# EAGLE design flight_logger_r1 (EAGLE 5.07)
MANUF: diodes:DMP2160UW;; PARTNUM: DMP2160UW

## Sheet 1 of 3
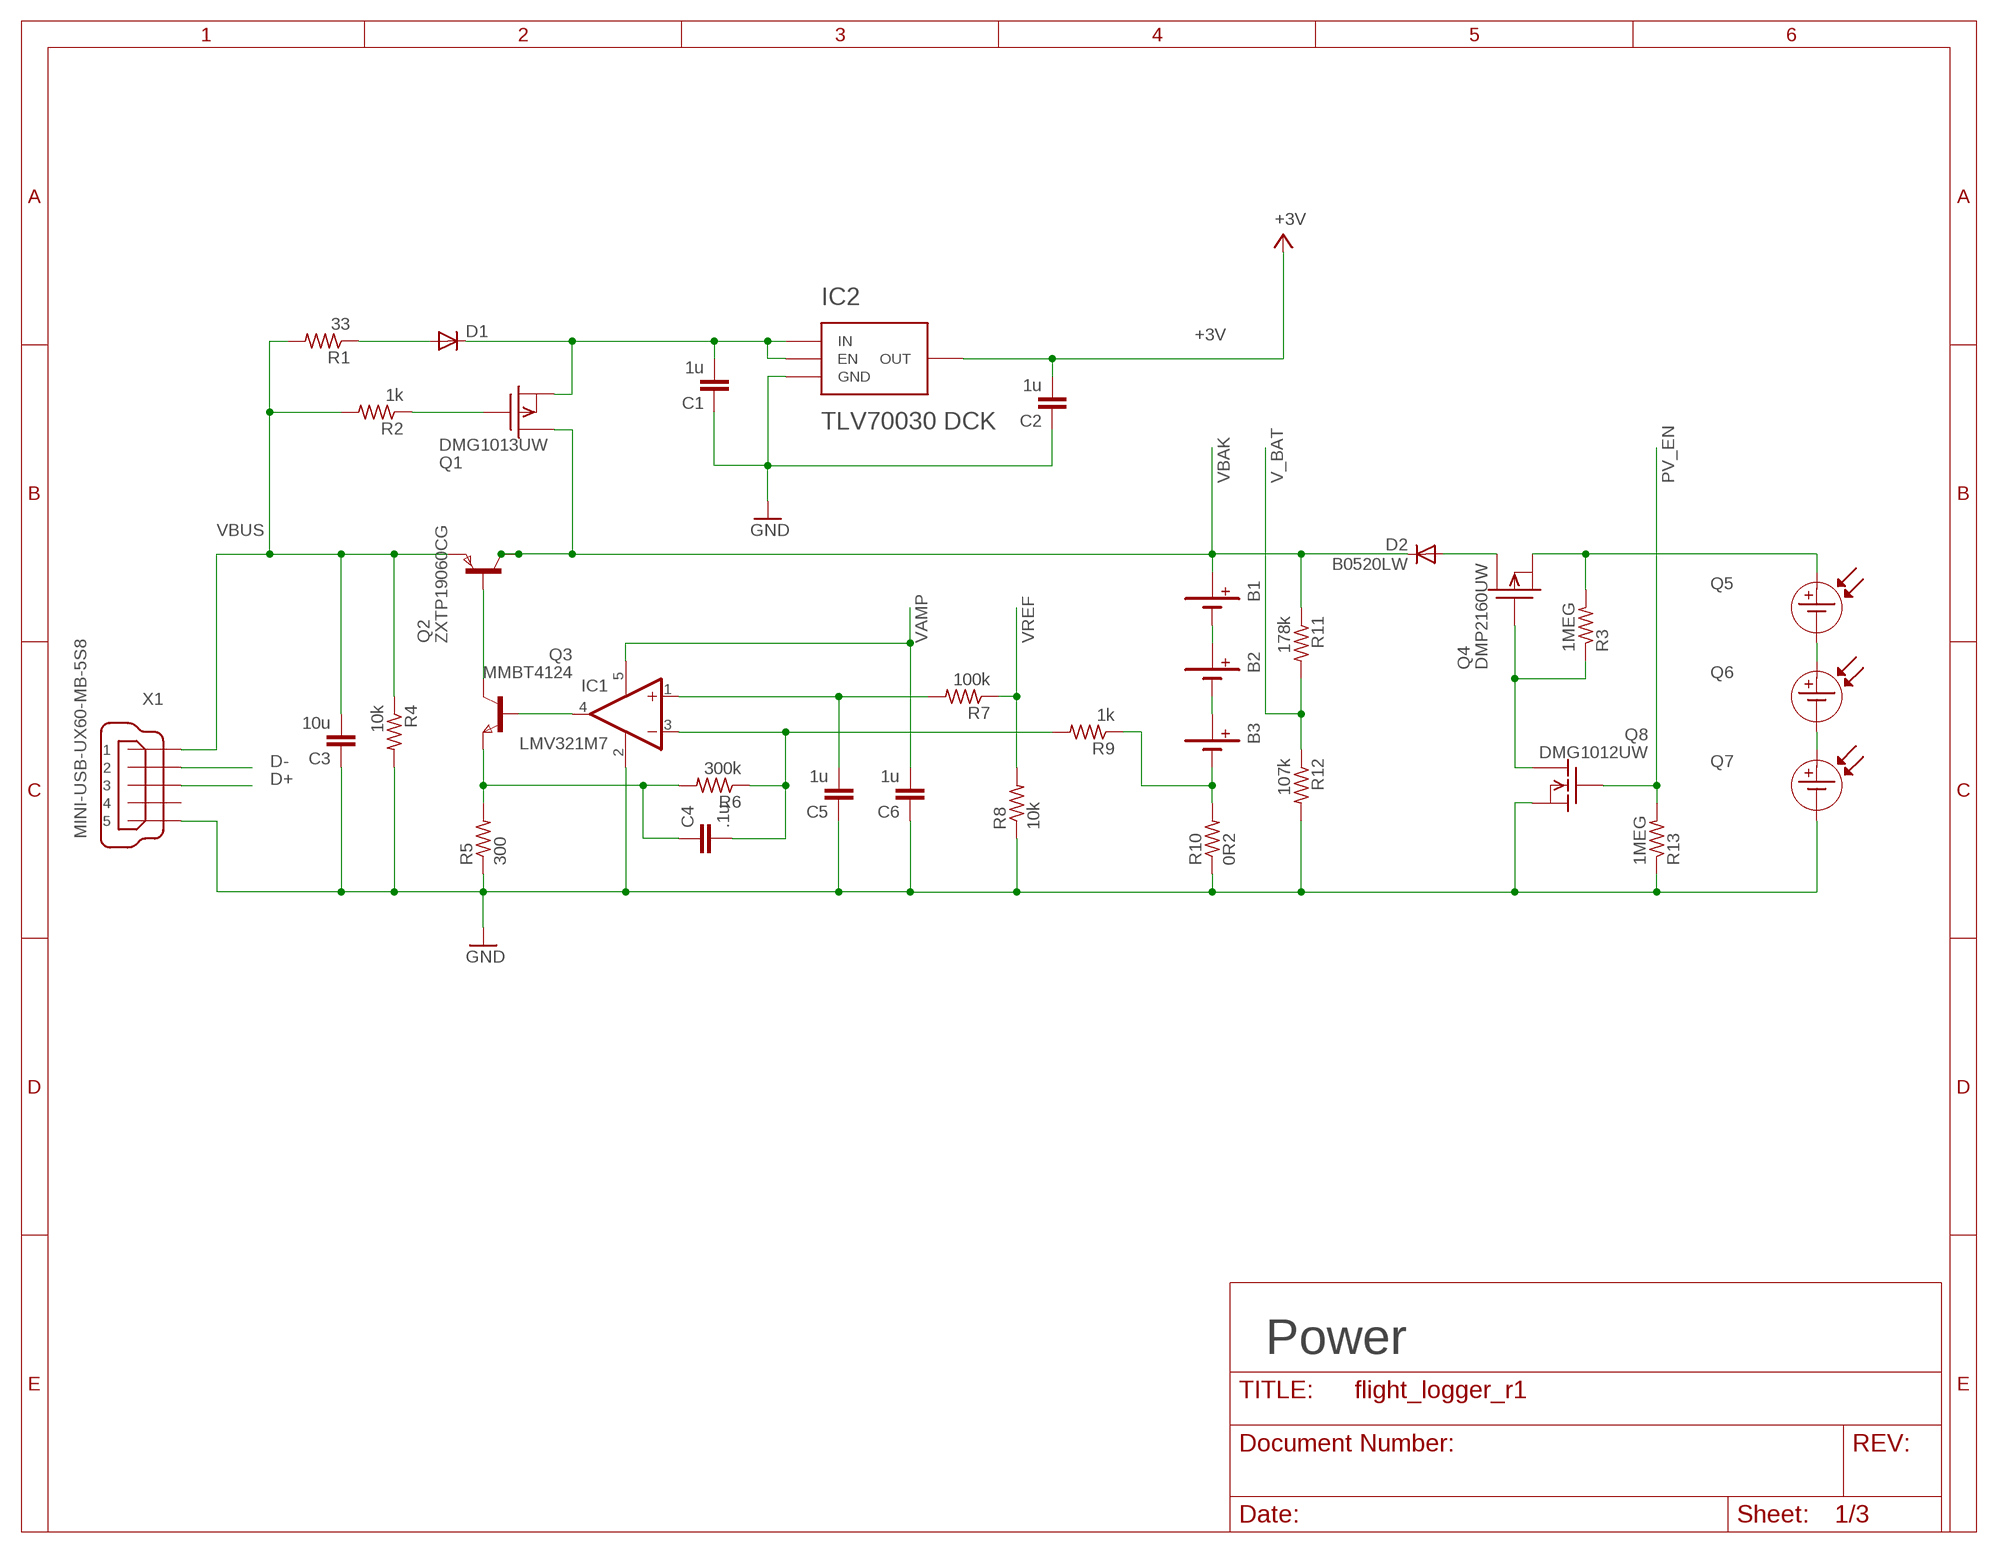
[diagram p0: schematic, sheet 1]

### Parts
B1  BATTERY-AA  [BATTERY-AA]
B2  BATTERY-AA  [BATTERY-AA]
B3  BATTERY-AA  [BATTERY-AA]
C1  1u  C-EUC0805  [C0805]
C2  1u  C-EUC0805  [C0805]
C3  10u  C-EUC0805  [C0805]
C4  .1u  C-EUC0805  [C0805]
C5  1u  C-EUC0805  [C0805]
C6  1u  C-EUC0805  [C0805]
D1  DIODE-MINIMELF  [MINIMELF]
D2  B0520LW  DIODE-SOD123  [SOD123]
IC1  LMV321M7  [SC70-5L]
IC2  TLV70030 DCK  TLV700XX_DCK  [SC70-5_DCK]
Q1  DMG1013UW  [SOT323]
Q2  ZXTP19060CG  PNPSOT223  [SOT223]
Q3  MMBT4124  NPNSOT23  [SOT-23]
Q4  DMP2160UW  DMG1013UW  [SOT323]
Q5  XOB17-04X3  [XOB17-SOLARCELL]
Q6  XOB17-04X3  [XOB17-SOLARCELL]
Q7  XOB17-04X3  [XOB17-SOLARCELL]
Q8  DMG1012UW  [SOT323]
R1  33  R-US_R0805  [R0805]
R2  1k  R-US_R0805  [R0805]
R3  1MEG  R-US_R0805  [R0805]
R4  10k  R-US_R0805  [R0805]
R5  300  R-US_R0805  [R0805]
R6  300k  R-US_R0805  [R0805]
R7  100k  R-US_R0805  [R0805]
R8  10k  R-US_R0805  [R0805]
R9  1k  R-US_R0805  [R0805]
R10  0R2  R-US_R1210  [R1210]
R11  178k  R-US_R0805  [R0805]
R12  107k  R-US_R0805  [R0805]
R13  1MEG  R-US_R0805  [R0805]
X1  MINI-USB-UX60-MB-5S8  [UX60-MB-5S8]

### Nets
+3V: C2.2 IC2.5(OUT) ; also sheet 2,3
D+: X1.3 ; also sheet 3
D-: X1.2 ; also sheet 3
GND: C1.1 C2.1 C3.1 C5.1 C6.1 IC1.2(V-) IC2.2(GND) Q7.NEG(-) Q8.2(S) R4.2 R5.1 R8.1 R10.1 R12.2 R13.1 X1.5 ; also sheet 2,3
N$1: Q2.1(B) Q3.1(C)
N$2: C4.1 Q3.2(E) R5.2 R6.2
N$4: B1.NEG(-) B2.POS(+)
N$5: B2.NEG(-) B3.POS(+)
N$6: Q5.NEG(-) Q6.POS(+)
N$7: D1.A R1.1
N$8: IC1.4(OUT) Q3.3(B)
N$9: C4.2 IC1.3(-IN) R6.1 R9.2
N$10: Q1.1(G) R2.1
N$11: Q4.2(S) Q5.POS(+) R3.2
N$12: C1.2 D1.C IC2.1(IN) IC2.3(EN) Q1.2(S)
N$13: D2.A Q4.3(D)
N$18: B3.NEG(-) R9.1 R10.2
N$33: C5.2 IC1.1(+IN) R7.2
N$34: Q6.NEG(-) Q7.POS(+)
N$35: Q4.1(G) Q8.3(D) R3.1
PV_EN: Q8.1(G) R13.2 ; also sheet 2
V_BAT: R11.2 R12.1 ; also sheet 2
VAMP: C6.2 IC1.5(V+) ; also sheet 2
VBAK: B1.POS(+) D2.C Q1.3(D) Q2.2(C) Q2.4(C1) R11.1 ; also sheet 3
VBUS: C3.2 Q2.3(E) R1.2 R2.2 R4.1 X1.1 ; also sheet 3
VREF: R7.1 R8.2 ; also sheet 2
Unconnected: X1.4

### Notes on the sheet
- Power

## Sheet 2 of 3
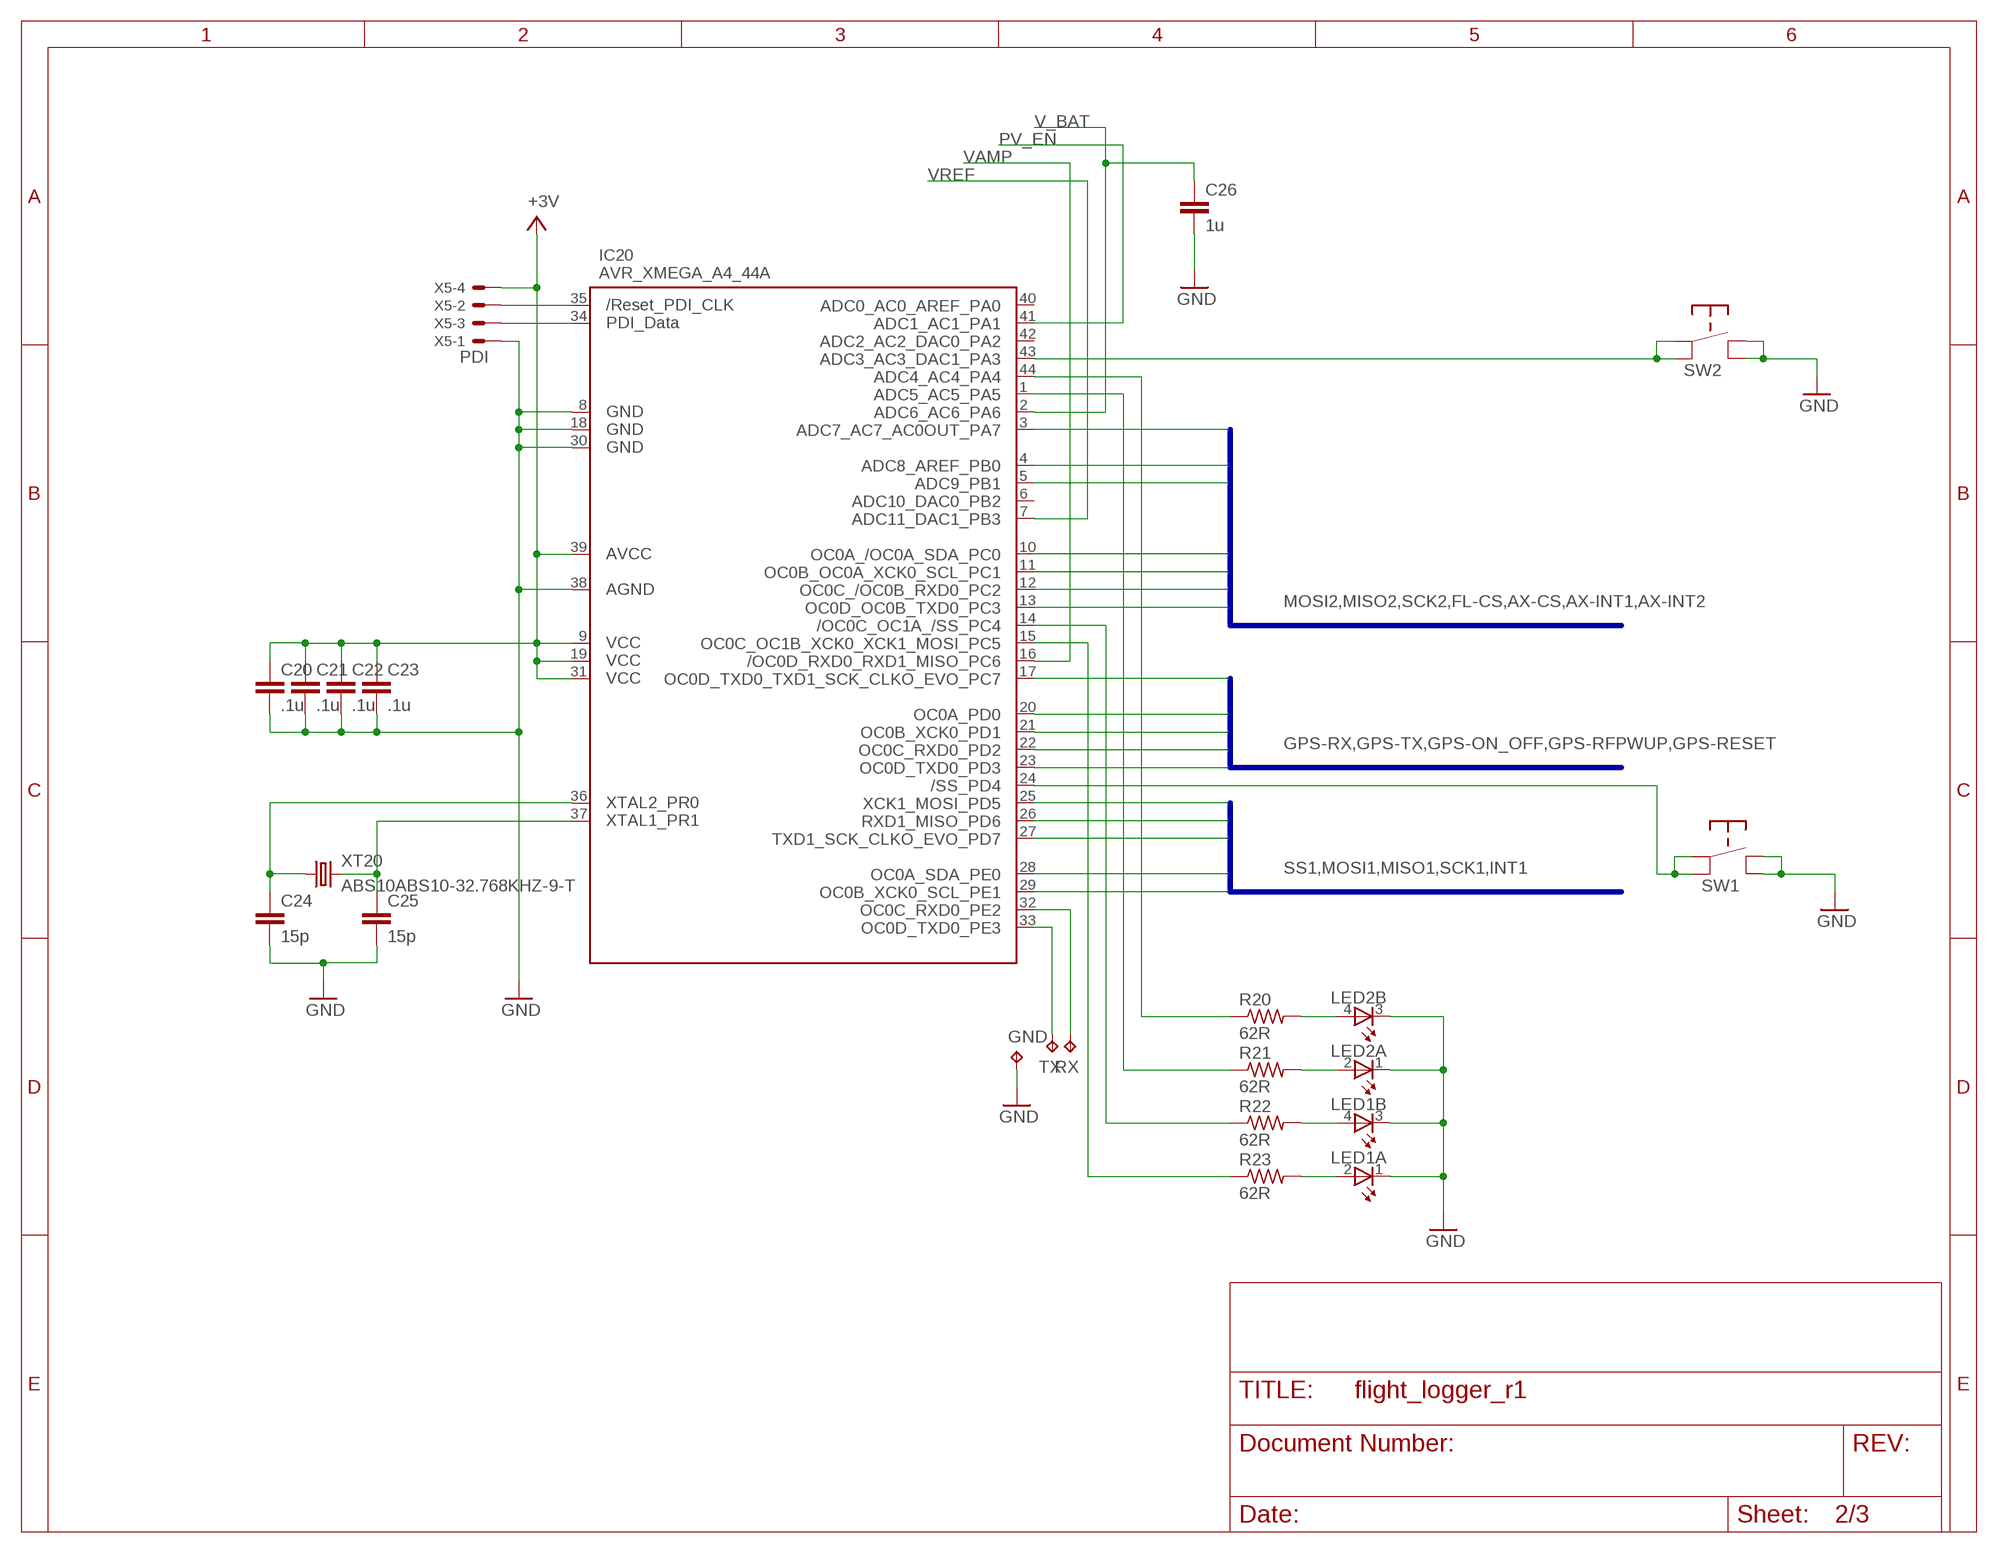
[diagram p1: schematic, sheet 2]

### Parts
C20  .1u  C-EUC0603  [C0603]
C21  .1u  C-EUC0603  [C0603]
C22  .1u  C-EUC0603  [C0603]
C23  .1u  C-EUC0603  [C0603]
C24  15p  C-EUC0603  [C0603]
C25  15p  C-EUC0603  [C0603]
C26  1u  C-EUC0805  [C0805]
GND  TPTP10R  [TP10R]
IC20  AVR_XMEGA_A4_44A  [TQFP44]
LED1  TOPLED-2-LSG_T676_SMALLPAD  [P-LCC-4_SMALLPAD]
LED2  TOPLED-2-LSG_T676_SMALLPAD  [P-LCC-4_SMALLPAD]
R20  62R  R-US_R0805  [R0805]
R21  62R  R-US_R0805  [R0805]
R22  62R  R-US_R0805  [R0805]
R23  62R  R-US_R0805  [R0805]
RX  TPTP10R  [TP10R]
SW1  Mark  PANASONIC-EVQP2  [PANASONIC_EVQP2_TACT-SWITCH]
SW2  Power  PANASONIC-EVQP2  [PANASONIC_EVQP2_TACT-SWITCH]
TX  TPTP10R  [TP10R]
X5  PDI  53047-04  [53047-04]
XT20  ABS10ABS10-32.768KHZ-9-T  ABS10-32.768KHZ-9-T  [ABS10_SMD_CRYSTAL]

### Nets
+3V: C20.1 C21.1 C22.1 C23.1 IC20.9(VCC1) IC20.19(VCC2) IC20.31(VCC3) IC20.39(AVCC) X5.4 ; also sheet 1,3
AX-CS: IC20.5(PB1) ; also sheet 3
AX-INT1: IC20.4(PB0) ; also sheet 3
AX-INT2: IC20.3(PA7) ; also sheet 3
DEBUG-RX: IC20.32(PE2) RX.TP
DEBUG-TX: IC20.33(PE3) TX.TP
FL-CS: IC20.10(PC0) ; also sheet 3
GND: C20.2 C21.2 C22.2 C23.2 C24.2 C25.2 C26.2 GND.TP IC20.8(GND1) IC20.18(GND2) IC20.30(GND3) IC20.38(AGND) LED1.1(A:C) LED1.3(B:C) LED2.1(A:C) LED2.3(B:C) SW1.1(NO) SW1.3(NO) SW2.1(NO) SW2.3(NO) X5.1 ; also sheet 1,3
GPS-ON_OFF: IC20.21(PD1) ; also sheet 3
GPS-RESET: IC20.20(PD0) ; also sheet 3
GPS-RFPWUP: IC20.17(PC7) ; also sheet 3
GPS-RX: IC20.23(PD3) ; also sheet 3
GPS-TX: IC20.22(PD2) ; also sheet 3
INT1: IC20.28(PE0) ; also sheet 3
MISO1: IC20.26(PD6) ; also sheet 3
MISO2: IC20.12(PC2) ; also sheet 3
MOSI1: IC20.27(PD7) ; also sheet 3
MOSI2: IC20.13(PC3) ; also sheet 3
N$14: C24.1 IC20.36(PR0) XT20.P$1
N$15: C25.1 IC20.37(PR1) XT20.P$2
N$21: IC20.15(PC5) R23.1
N$22: LED2.4(B:A) R20.2
N$23: LED2.2(A:A) R21.2
N$24: IC20.14(PC4) R22.1
N$25: IC20.1(PA5) R21.1
N$26: LED1.4(B:A) R22.2
N$27: LED1.2(A:A) R23.2
N$28: IC20.35(RESET) X5.2
N$29: IC20.34(PDI_DATA) X5.3
N$30: IC20.43(PA3) SW2.2(COMMON) SW2.4(COMMON)
N$31: IC20.44(PA4) R20.1
N$32: IC20.24(PD4) SW1.2(COMMON) SW1.4(COMMON)
PV_EN: IC20.41(PA1) ; also sheet 1
SCK1: IC20.25(PD5) ; also sheet 3
SCK2: IC20.11(PC1) ; also sheet 3
SS1: IC20.29(PE1) ; also sheet 3
V_BAT: C26.1 IC20.2(PA6) ; also sheet 1
VAMP: IC20.16(PC6) ; also sheet 1
VREF: IC20.7(PB3) ; also sheet 1
Unconnected: IC20.6(PB2) IC20.40(PA0) IC20.42(PA2)

### Buses
SS1,MOSI1,MISO1,SCK1,INT1
GPS-RX,GPS-TX,GPS-ON_OFF,GPS-RFPWUP,GPS-RESET
MOSI2,MISO2,SCK2,FL-CS,AX-CS,AX-INT1,AX-INT2

## Sheet 3 of 3
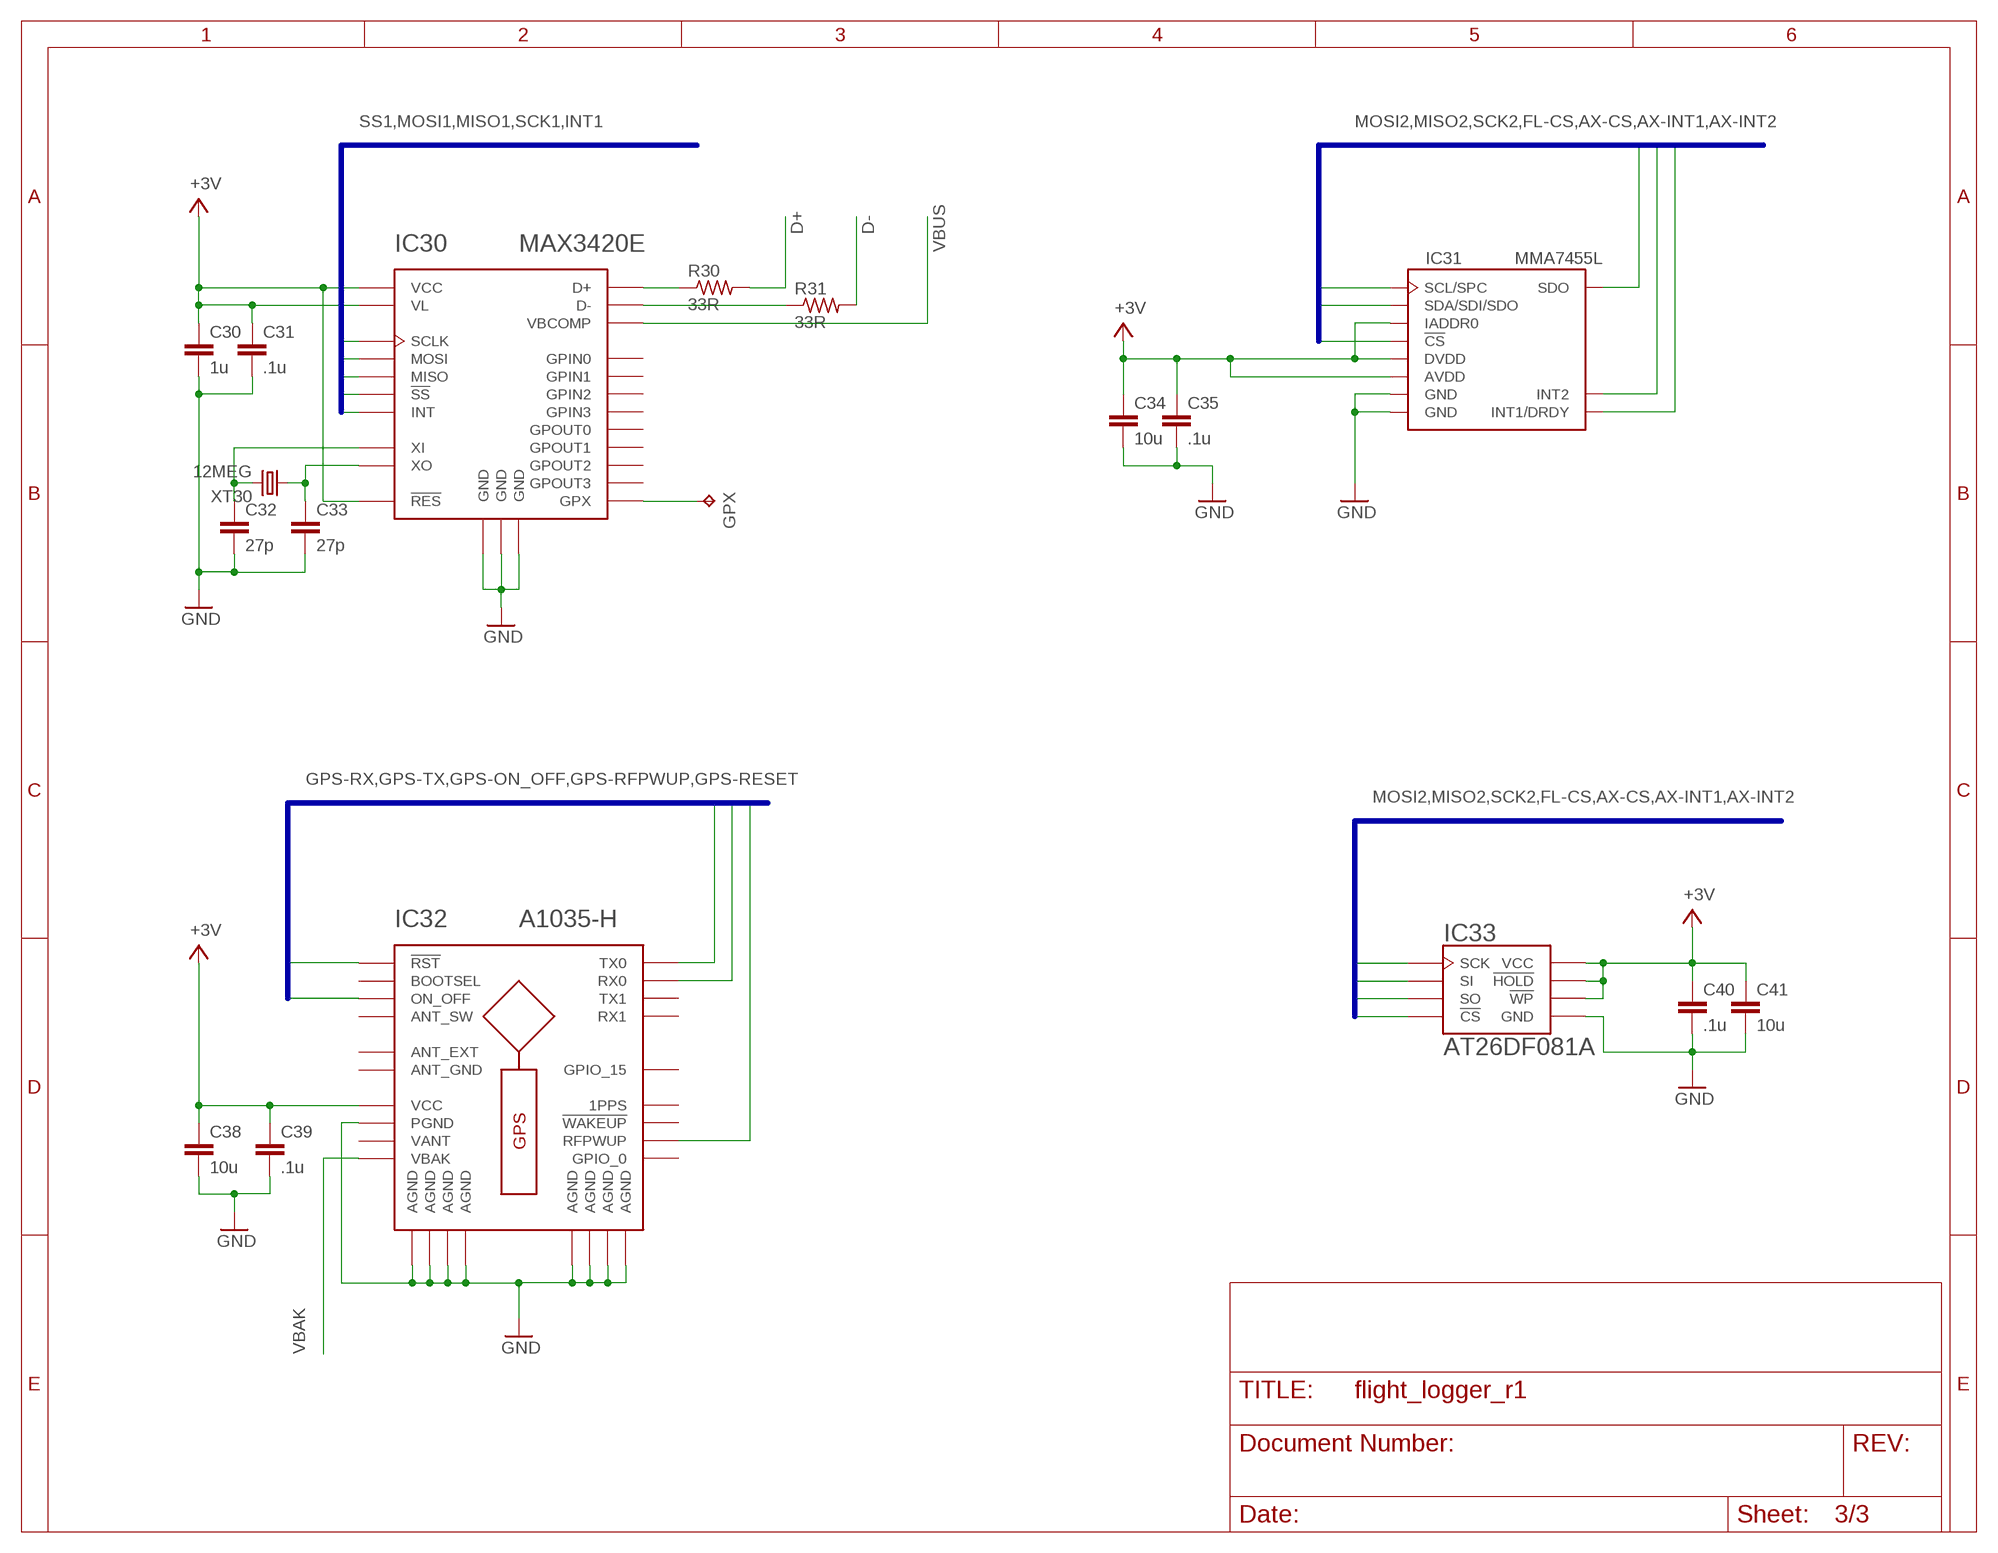
[diagram p2: schematic, sheet 3]

### Parts
C30  1u  C-EUC0805  [C0805]
C31  .1u  C-EUC0805  [C0805]
C32  27p  C-EUC0805  [C0805]
C33  27p  C-EUC0805  [C0805]
C34  10u  C-EUC0805  [C0805]
C35  .1u  C-EUC0805  [C0805]
C38  10u  C-EUC0805  [C0805]
C39  .1u  C-EUC0805  [C0805]
C40  .1u  C-EUC0805  [C0805]
C41  10u  C-EUC0805  [C0805]
GPX  TPTP10R  [TP10R]
IC30  MAX3420E  MAX3420EETG  [TQFN24]
IC31  MMA7455L  MMA7455LLARGEPAD  [LGA-14-LARGEPAD]
IC32  A1035-H  VINCOTECH-GPS_A1035-H  [A1035-H_GPS]
IC33  AT26DF081A  AT26DF081A-SU  [EIAJ-SOIC8]
R30  33R  R-US_R0805  [R0805]
R31  33R  R-US_R0805  [R0805]
XT30  12MEG  ABMM-XTAL  [XTAL-5.2X7.2]

### Nets
+3V: C30.1 C31.1 C34.1 C35.1 C38.1 C39.1 C40.1 C41.1 IC30.3(VL) IC30.7(!RES) IC30.17(VCC) IC31.1(DVDD) IC31.4(IADDR0) IC31.6(AVDD) IC32.3(VCC) IC33.3(!WP) IC33.7(!HOLD) IC33.8(VCC) ; also sheet 1,2
AX-CS: IC31.7(!CS) ; also sheet 2
AX-INT1: IC31.8(INT1/DRDY) ; also sheet 2
AX-INT2: IC31.9(INT2) ; also sheet 2
D+: R30.2 ; also sheet 1
D-: R31.2 ; also sheet 1
FL-CS: IC33.1(!CS) ; also sheet 2
GND: C30.2 C31.2 C32.2 C33.2 C34.2 C35.2 C38.2 C39.2 C40.2 C41.2 IC30.4(GND) IC30.14(GND) IC30.PAD(GND) IC31.2(GND) IC31.5(GND) IC32.6(PGND) IC32.GND@1(AGND) IC32.GND@2(AGND) IC32.GND@3(AGND) IC32.GND@4(AGND) IC32.GND@5(AGND) IC32.GND@6(AGND) IC32.GND@7(AGND) IC32.GND@8(AGND) IC33.4(GND) ; also sheet 1,2
GPS-ON_OFF: IC32.17(ON_OFF) ; also sheet 2
GPS-RESET: IC32.1(!RST) ; also sheet 2
GPS-RFPWUP: IC32.4(RFPWUP) ; also sheet 2
GPS-RX: IC32.21(RX0) ; also sheet 2
GPS-TX: IC32.20(TX0) ; also sheet 2
INT1: IC30.13(INT) ; also sheet 2
MISO1: IC30.10(MISO) ; also sheet 2
MISO2: IC31.12(SDO) IC33.2(SO) ; also sheet 2
MOSI1: IC30.11(MOSI) ; also sheet 2
MOSI2: IC31.13(SDA/SDI/SDO) IC33.5(SI) ; also sheet 2
N$3: GPX.TP IC30.12(GPX)
N$16: C33.1 IC30.20(XO) XT30.1
N$17: C32.1 IC30.19(XI) XT30.3
N$19: IC30.16(D+) R30.1
N$20: IC30.15(D-) R31.1
SCK1: IC30.8(SCLK) ; also sheet 2
SCK2: IC31.14(SCL/SPC) IC33.6(SCK) ; also sheet 2
SS1: IC30.9(!SS) ; also sheet 2
VBAK: IC32.14(VBAK) ; also sheet 1
VBUS: IC30.18(VBCOMP) ; also sheet 1
Unconnected: IC30.1(GPOUT0) IC30.2(GPOUT1) IC30.5(GPOUT2) IC30.6(GPOUT3) IC30.21(GPIN0) IC30.22(GPIN1) IC30.23(GPIN2) IC30.24(GPIN3) IC32.2(BOOTSEL) IC32.5(GPIO_15) IC32.7(ANT_GND) IC32.8(ANT_EXT) IC32.12(ANT_SW) IC32.13(GPIO_0) IC32.15(1PPS) IC32.16(!WAKEUP) IC32.18(RX1) IC32.19(TX1)

### Buses
SS1,MOSI1,MISO1,SCK1,INT1
GPS-RX,GPS-TX,GPS-ON_OFF,GPS-RFPWUP,GPS-RESET
MOSI2,MISO2,SCK2,FL-CS,AX-CS,AX-INT1,AX-INT2

## Power pins joined to a net without a drawn wire
VANT: IC32.9(VANT)

## Library data of the parts
B1-B3 = connector:BATTERY-: AA Battery with tabs Surface mounted AA battery using tabs Based on Panasonic HHR210AA/B NiMH rechargeable
C1-C6 C20-C26 C30-C35 C38-C41 = rcl:C-EU: CAPACITOR, European symbol
D1 D2 = diode:DIODE-: DIODE
GND GPX RX TX = testpad:TP: Test pad
IC1 = linear:LMV321?*: General Purpose, Low Voltage, Rail-to-Rail Output Operational Amplifiers Source: http://www.national.com/mpf/LM/LMV321.html http://www.national.com/dt/lmv_qual.pdf
IC2 = m_vreg:TLV700XX: Texas Instruments 200-mA, Low-IQ, Low-Dropout Regulator for Portable Devices The TLV700xx series of low-dropout (LDO) linear regulators are low quiescent current devices with excellent line and load transient performance. These LDOs are designed for power-sensitive applications. A precision bandgap and error amplifier provides overall 2% accuracy. Low output noise, very high power-supply rejection ratio (PSRR), and low dropout voltage make this series of devices ideal for most battery-operated handheld equipment. All device versions have thermal shutdown and current limit for safety. Furthermore, these devices are stable with an effective output capacitance of only 0.1 ?F. This feature enables the use of cost-effective capacitors that have higher bias voltages and temperature derating. The devices regulate to specified accuracy with no output load. The TLV700xx series of LDOs are available in 1,5-mm x 1,5-mm SON-6, SOT23-5, and SC-70 packages. FEATURES Very Low Dropout: 175 mV at 200 mA 2% Accuracy Low IQ: 31 ?A Available in Fixed-Output Voltages from 0.7 V to 4.8 V High PSRR: 68 dB at 1 kHz Stable with Effective Capacitance of 0.1 ?F Thermal Shutdown and Overcurrent Protection Available in 1,5-mm × 1,5-mm SON-6, SOT23-5, and SC-70 packages
IC20 = xmega:AVR_XMEGA_A4_: Device for Atmel AVR XMEGA A4 Series
IC30 = m_ic-comm:MAX3420E: USB Peripheral Controller with SPI Interface General Description The MAX3420E contains the digital logic and analog circuitry necessary to implement a full-speed USB peripheral compliant to USB specification rev 2.0. A built-in full-speed transceiver features ±15kV ESD pro- tection and programmable USB connect and discon- nect. An internal serial-interface engine (SIE) handles low-level USB protocol details such as error checking and bus retries. The MAX3420E operates using a regis- ter set accessed by an SPITM interface that operates up to 26MHz. Any SPI master (microprocessor, ASIC, DSP, etc.) can add USB functionality using the simple 3- or 4-wire SPI interface. Internal level translators allow the SPI interface to run at a system voltage between 1.71V and 3.6V. USB timed operations are done inside the MAX3420E with inter- rupts provided at completion so an SPI master does not need timers to meet USB timing requirements. The MAX3420E includes four general-purpose inputs and outputs so any microprocessor that uses I/O pins to implement the SPI interface can reclaim the I/O pins and gain additional ones. The MAX3420E operates over the extended -40°C to +85°C temperature range and is available in a 32-pin LQFP package (7mm x 7mm) and a space-saving 24- pin TQFN package (4mm x 4mm). Microprocessor-Independent USB Solution Complies with USB Specification Revision 2.0 (Full-Speed Operation) Integrated Full-Speed USB Transceiver Firmware/Hardware Control of an Internal D+ Pullup Resistor Programmable 3- or 4-Wire 26MHz SPI Interface Level Translators and VL Input Allow Independent System Interface Voltage Internal Comparator Detects VBUS for Self-Powered Applications ESD Protection on D+, D-, and VBCOMP Interrupt Output Pin (Level or Programmable Edge) Allows Polled or Interrupt-Driven SPI Interface Intelligent USB Serial-Interface Engine (SIE) Automatically Handles USB Flow Control and Double Buffering Handles Low-Level USB Signaling Details Contains Timers for USB Time-Sensitive Operations So SPI Master Does Not Need to Time Events Built-In Endpoint FIFOs EP0: CONTROL (64 Bytes) EP1: OUT, Bulk or Interrupt, 2 x 64 Bytes (Double-Buffered) EP2: IN, Bulk or Interrupt, 2 x 64 Bytes (Double-Buffered) EP3: IN, Bulk or Interrupt (64 Bytes) Double-Buffered Data Endpoints Increase Throughput by Allowing the SPI Master to Transfer Data Concurrently with USB Transfers Over the Same Endpoint SETUP Data Has Its Own 8-Byte FIFO, Simplifying Firmware Four General-Purpose Inputs and Four General- Purpose Outputs Space-Saving LQFP and TQFN Packages
IC31 = m_ic-signal:MMA7455L: Freescale Semiconductor ±2g/±4g/±8g Three Axis Low-g Digital Output Accelerometer The MMA7455L is a Digital Output (I2C/SPI), low power, low profile capacitive micromachined accelerometer featuring signal conditioning, a low pass filter, temperature compensation, self-test, configurable to detect 0g through interrupt pins (INT1 or INT2), and pulse detect for quick motion detection. 0g offset and sensitivity are factory set and require no external devices. The 0g offset can be customer calibrated using assigned 0g registers and g-Select which allows for command selection for 3 acceleration ranges (2g/4g/8g). The MMA7455L includes a Standby Mode that makes it ideal for handheld battery powered electronics. Features Digital Output (I2C/SPI) 3mm x 5mm x 1mm LGA-14 Package Self-Test for Z-Axis Low Voltage Operation: 2.4 V ? 3.6 V User Assigned Registers for Offset Calibration Programmable Threshold Interrupt Output Level Detection for Motion Recognition (Shock, Vibration, Freefall) Pulse Detection for Single or Double Pulse Recognition Sensitivity (64 LSB/g @ 2g and @ 8g in 10-Bit Mode) Selectable Sensitivity (±2g, ±4g, ±8g) for 8-bit Mode Robust Design, High Shocks Survivability (5,000g) RoHS Compliant Environmentally Preferred Product Low Cost; PARTNUM: MMA7455L
IC32 = m_module:VINCOTECH-GPS_A1035-H: Vincotech GPS Module Vincotech's GPS receiver module / smart antenna A1035-H is a highly integrated GPS antenna receiver module based on the technology of the GPS receiver module A1084 and a ceramic GPS patch antenna. Like on the A1084-A an RF switch is integrated on the module allowing changing of RF input from the on-module antenna to an external antenna. The module is capable of receiving signals from up to 20 GPS satellites and transferring them into position and timing information that can be read over a serial port. Small size and high-end GPS functionality are combined at low power consumption. Operable at 3.3V / 24mA (typ.) @ 1fix per second UART interface at CMOS level Small form factor of 30.48 x 16.51 mm2 (1.2? x 0.65?) Supported temperature range: -40°C to +85°C Single-sided SMT component, for reflow soldering RoHS compliant, lead-free Tape & reel packaging Excellent antenna support On-module patch antenna Antenna input for direct connection of external active antenna RF switch to select between antennas The receiver / smart antenna module is available as an off-the-shelf component, 100% tested and shipped in tape-and-reel.
IC33 = m_ic-other:AT26DF081A: Atmel 8-megabit 2.7-volt Minimum SPI Serial Flash Memory The AT26DF081A is a serial interface Flash memory device designed for use in a wide variety of high-volume consumer-based applications in which program code is shadowed from Flash memory into embedded or external RAM for execution. The flexible erase architecture of the AT26DF081A, with its erase granularity as small as 4 Kbytes, makes it ideal for data storage as well, eliminating the need for additional data storage EEPROM devices. The physical sectoring and the erase block sizes of the AT26DF081A have been optimized to meet the needs of today's code and data storage applications. By optimizing the size of the physical sectors and erase blocks, the memory space can be used much more efficiently. Because certain code modules and data storage segments must reside by themselves in their own protected sectors, the wasted and unused memory space that occurs with large sectored and large block erase Flash memory devices can be greatly reduced. This increased memory space efficiency allows additional code routines and data storage segments to be added while still maintaining the same overall device density. Single 2.7V - 3.6V Supply Serial Peripheral Interface (SPI) Compatible Supports SPI Modes 0 and 3 70 MHz Maximum Clock Frequency Flexible, Uniform Erase Architecture 4-Kbyte Blocks 32-Kbyte Blocks 64-Kbyte Blocks Full Chip Erase Individual Sector Protection with Global Protect/Unprotect Feature One 32-Kbyte Top Boot Sector Two 8-Kbyte Sectors One 16-Kbyte Sector Fifteen 64-Kbyte Sectors Hardware Controlled Locking of Protected Sectors Flexible Programming Options Byte/Page Program (1 to 256 Bytes) Sequential Program Mode Capability Automatic Checking and Reporting of Erase/Program Failures JEDEC Standard Manufacturer and Device ID Read Methodology Low Power Dissipation 5 mA Active Read Current (Typical) 25 ?A Deep Power-down Current (Typical) Endurance: 100,000 Program/Erase Cycles Data Retention: 20 Years Complies with Full Industrial Temperature Range Industry Standard Green (Pb/Halide-free/RoHS Compliant) Package Options 8-lead SOIC (150-mil and 200-mil wide)
LED1 LED2 = m_opto:TOPLED-2-: Multi TOPLED® (two color) LG T672, LP T672 LSY T67B LSW T67C LSY T675 LSY T676 LSG T677 LSG T770 Source: http://www.osram.convergy.de/; PARTNUM: LSG T676-
Q1 Q4 = m_transistor:DMG1013UW: DMG1013UW P-CHANNEL ENHANCEMENT MODE MOSFET Features Low On-Resistance Low Gate Threshold Voltage Low Input Capacitance Fast Switching Speed Low Input/Output Leakage Lead Free By Design/RoHS Compliant (Note 1) ESD Protected Up To 3KV "Green" Device (Note 2) Qualified to AEC-Q101 Standards for High Reliability; MANUF: diodes:DMG1013UW;; PARTNUM: DMG1013UW
Q2 = zetex:PNPSOT223: PNP TRANSISTOR
Q3 = zetex:NPNSOT23: NPN TRANSISTOR
Q5-Q7 = m_opto:XOB17: IXOLARTM High Efficiency SolarBIT Description IXOLARTM SolarBITs are IXYS? product line of coated monocrystalline, high efficiency solar cell products using IXYS? XOD17 bondable solar cell dies. SolarBITs have reflow solderable surface mount packages, they are available in tape and reel packages and can be automatically pick and place mounted. There are 3 different SolarBITs available with different voltage and current output. The IXOLARTM SolarBITs are ideal for charging various battery powered and handheld consumer products such as mobile phones, cameras, PDAs, MP3-Players and toys. They are also suitable for industrial applications such as wireless sensors, portable instrumentation and for charging emergency backup batteries. With a cell efficiency of typically 17%, SolarBITs give the ability to extend run time even in "low light" conditions and increase battery life and run time in a small footprint, which can be easily accommodated in the design of Portable Products. The design allows connecting SolarBITs flexibly in series and/or parallel to perfectly meet the application?s power requirements. IXOLARTM products have a very good response over a wide wavelength range and therefore can be used in both indoor and outdoor applications. Product and Ordering Information Part Number Open Circuit Voltage [V] Short Circuit Current [mA] Typ. Voltage @ Pmpp [V] Typ. Current @ Pmpp [mA] XOB17-12x1 0.63 42.0 0.51 39.0 XOB17-04x3 1.89 12.6 1.53 11.7 XOB17-01x8 4.90 4.2 4.00 3.9 (parameters given are typical values) Dimensions(LxWxH): 22x7x1.6[mm] SolarBIT Weight: 0.5 grams SolarBITs are compliant to the RoHS Norm. Source: IXYS Technical Information XOB17, Rev. Jun. 2009; PARTNUM: XOB17-04x3
Q8 = m_transistor:DMG1012UW: N-CHANNEL ENHANCEMENT MODE MOSFET; MANUF: diodes:DMG1012UW;; PARTNUM: DMG1012UW
R1-R13 R20-R23 R30 R31 = rcl:R-US_: RESISTOR, American symbol
SW1 SW2 = m_switch-mechanical:PANASONIC-EVQP2: 4.7 mm3.5 mm SMD Light Touch Switches; PARTNUM: EVQP2xxxx
X1 = con-hirose:MINI-USB-: MINI USB Connector Source: http://www.hirose.co.jp/cataloge_hp/e24000019.pdf
X5 = con-molex:53?-04: CONNECTOR wire to board 1.25 mm (.049 inch) pitch header
XT20 = m_misc:ABS10: 32.768kHz SMD LOW PROFILE CRYSTAL FEATURES: Low frequency in small size SMD 1.0mm height ideal for high density circuit boards Ceramic package offers excellent environmental & heat resistance Extended temperature -40°C to +85°C for industrial applications PARAMETERS ABRACON P/N ABS10 Nominal Frequency 32.768 kHz Operating Temperature -40°C to + 85°C Turn-over Temperature +25°C to ±5°C Storage Temperature -55°C to +125°C Frequency Tolerance ±20 ppm max. (see option) Temperature Coefficient (beta) - 0.034±0.006 ppm/T2 Equivalent Series Resistance 70 kohms max. Load Capacitance CL 12.5 pF (see option) Drive Level 1.0 ?W max. Aging (first year) 25°C ± 5 ppm max. Insulation Resistance 500 M? with 100 Vdc ±15V Shunt capacitance Co 1.0pF typ. Motional capacitance C1 2.0fF typ.; PARTNUM: ABS10-32.768KHZ-9-T
XT30 = m_misc:ABMM-XTAL: Surface Mount Crystal PARAMETERS ABRACON P/N ABMM Frequency Range 6.0 MHz to 125 MHz Operation Mode AT-cut 6.0 MHz ~ 33.0 MHz (Fundamental: Standard) 33.01 MHz - 125 MHz (Third-Overtone: Standard) 33.01 MHz ~ 50.0 MHz (Fundamental: See options) Operating Temperature - 10°C to + 60°C (see options) Storage Temperature - 40°C to + 85°C Frequency Tolerance at +25°C ± 50 ppm max. (see options) Frequency Stability over the Operating Temp. (Ref to +25°C) ± 50 ppm max. (see options) Equivalent Series Resistance See Table 1 Shunt Capacitance C0 7pF max. Load Capacitance CL 18pF (see options) Drive Level 500?W max., 100?W typical Aging at 25°C Per Year ± 5ppm max. Insulation Resistance 500? min at 100Vdc ± 15V Frequency (MHz) ESR (?) Frequency (MHz) ESR (?) 6.000 - 11.999(Fund) 70 20.000 - 50.000(Fund) 40 12.000 - 20.000(Fund) 50 33.000 - 125.00(3rd O/T) 80; PARTNUM: ABMM-Freq-_-R___-_-_-_-_-_

## Board
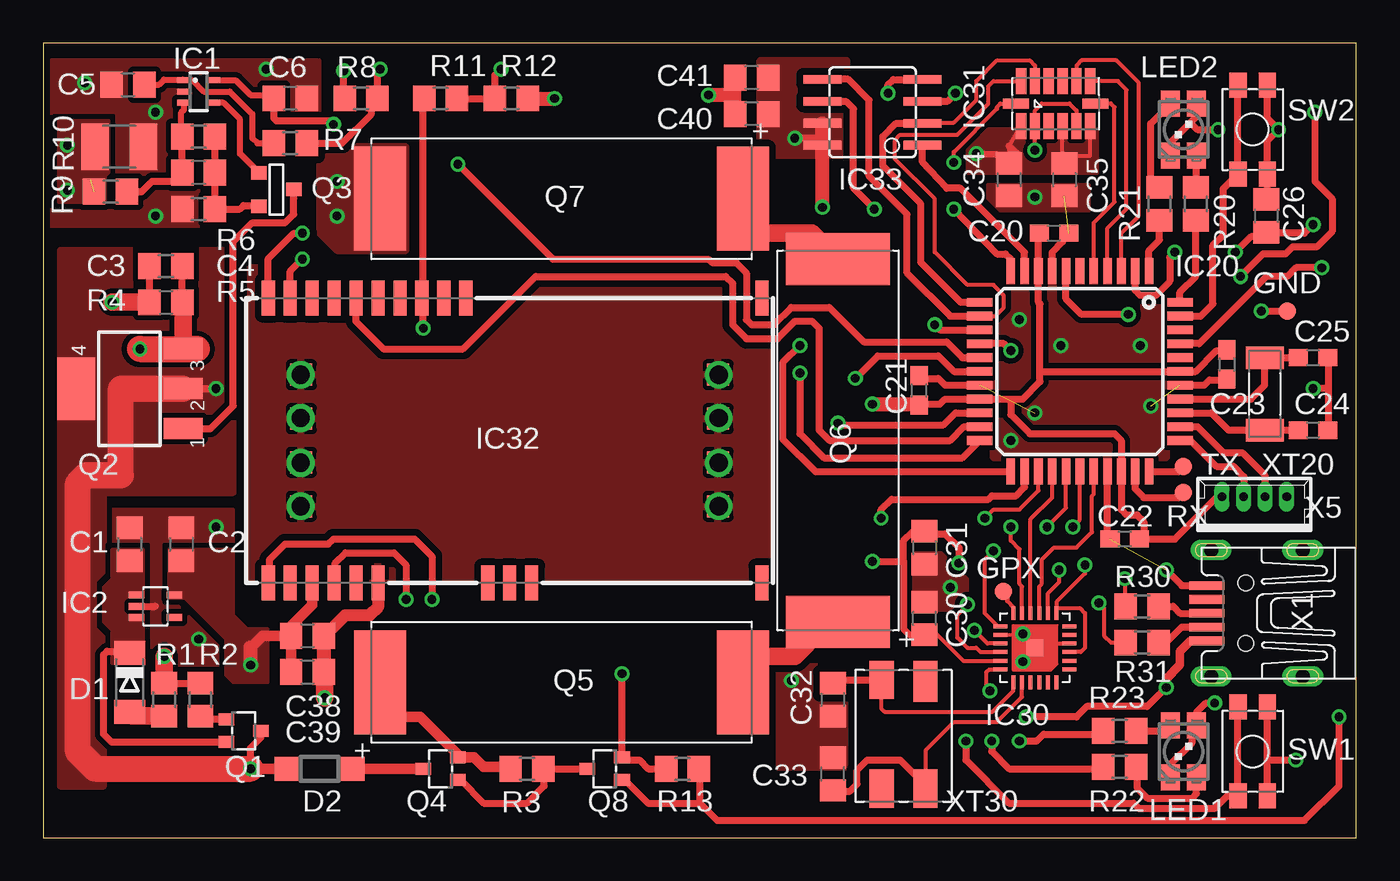
[diagram p3: board, top side]
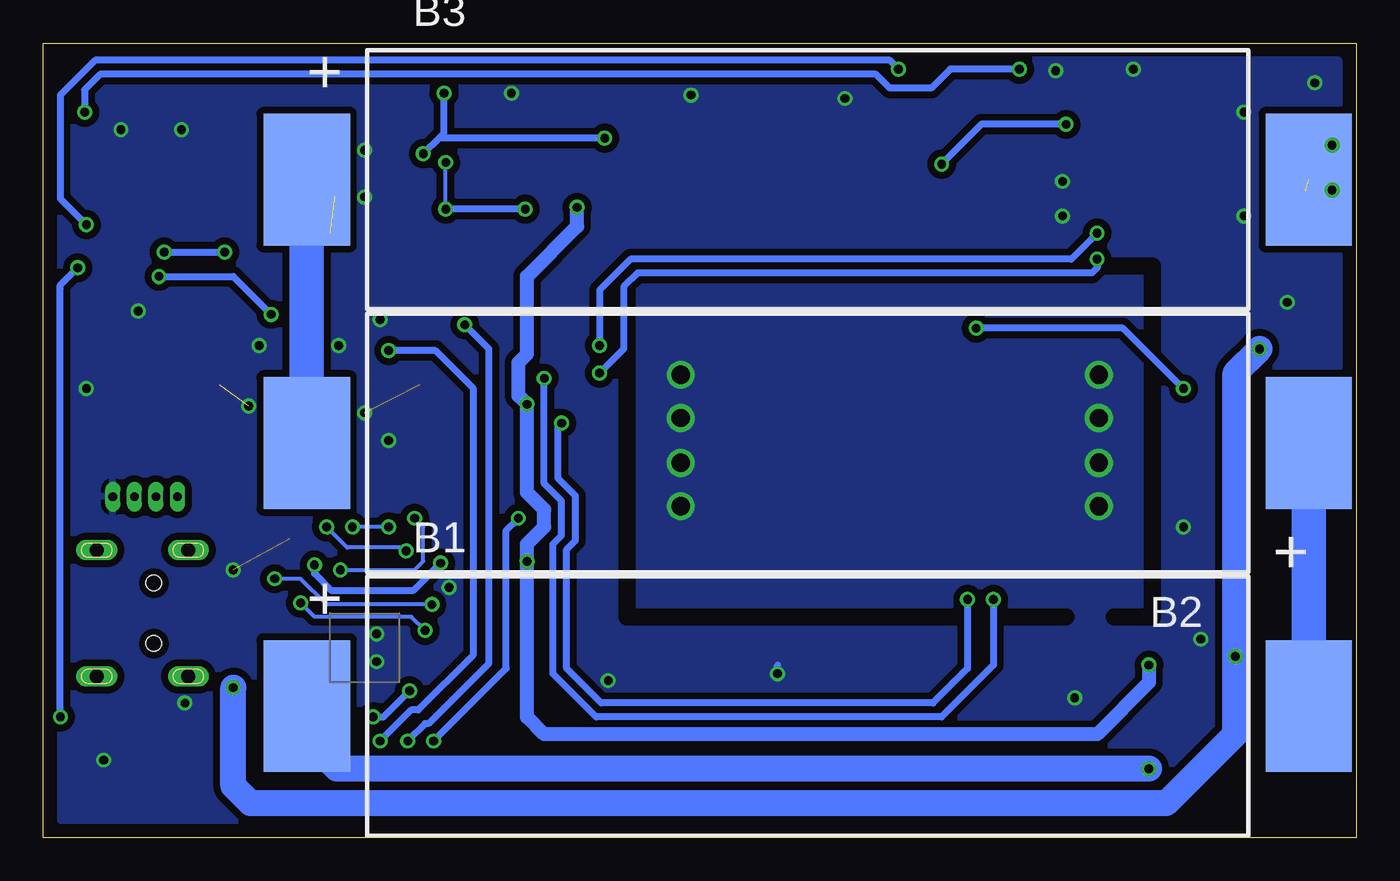
[diagram p4: board, bottom side, seen from below]

Size 76 x 46 mm. Coordinates in mm from the lower left corner, seen from the top.
Outline: 0,0 76,0 76,46 0,46 0,0
Copper layers (1*16): Top 0.035mm / dielectric 1.5mm / Bottom 0.035mm
Design rules "advanced-circuits_7mil *": minimum track width 7mil, minimum drill 10mil, track to track 7mil, track to pad 7mil, pad to pad 7mil, via to via 7mil, smd to smd 0mil, copper to edge 15mil, drill to drill 15mil, minimum pad ring 7mil, minimum via ring 7mil, stop-mask expansion 2.5mil, vias tented up to drill 20mil, thermal gap 10mil
bRestrict: 5 lines

### Footprints (pad centres in the part's own frame; a part is rotated, then mirrored left to right if it is on the bottom)
BATTERY-AA = smd 5 x 7.62: NEG 29,0; POS -29,0
C0805 = smd 1.3 x 1.5: 1 -0.95,0; 2 0.95,0
C0603 = smd 1.1 x 1: 1 -0.85,0; 2 0.85,0
MINIMELF = smd 1.4 x 1.8: A 1.7,0; C -1.7,0
SOD123 = smd 1.4 x 1.4: A 1.9,0; C -1.9,0
TP10R = smd 1 x 1: TP 0,0
SC70-5L = smd 0.35 x 0.8: 1 -0.65,-0.85; 2 0,-0.85; 3 0.65,-0.85; 4 0.65,0.85; 5 -0.65,0.85
SC70-5_DCK = smd 0.4 x 0.9: 1 -0.65,-1.1; 2 0,-1.1; 3 0.65,-1.1; 4 0.65,1.1; 5 -0.65,1.1
TQFP44 = smd 1.5 x 0.5: 1 -5.8,4; 2 -5.8,3.2; 3 -5.8,2.4; 4 -5.8,1.6; 5 -5.8,0.8; 6 -5.8,0; 7 -5.8,-0.8; 8 -5.8,-1.6; 9 -5.8,-2.4; 10 -5.8,-3.2; 11 -5.8,-4; 23 5.8,-4; 24 5.8,-3.2; 25 5.8,-2.4; 26 5.8,-1.6; 27 5.8,-0.8; 28 5.8,0; 29 5.8,0.8; 30 5.8,1.6; 31 5.8,2.4; 32 5.8,3.2; 33 5.8,4 | smd 0.5 x 1.5: 12 -4,-5.8; 13 -3.2,-5.8; 14 -2.4,-5.8; 15 -1.6,-5.8; 16 -0.8,-5.8; 17 0,-5.8; 18 0.8,-5.8; 19 1.6,-5.8; 20 2.4,-5.8; 21 3.2,-5.8; 22 4,-5.8; 34 4,5.8; 35 3.2,5.8; 36 2.4,5.8; 37 1.6,5.8; 38 0.8,5.8; 39 0,5.8; 40 -0.8,5.8; 41 -1.6,5.8; 42 -2.4,5.8; 43 -3.2,5.8; 44 -4,5.8
TQFN24 = smd 0.8 x 0.23: 1 -2,1.25; 2 -2,0.75; 3 -2,0.25; 4 -2,-0.25; 5 -2,-0.75; 6 -2,-1.25; 13 2,-1.25; 14 2,-0.75; 15 2,-0.25; 16 2,0.25; 17 2,0.75; 18 2,1.25 | smd 0.23 x 0.8: 7 -1.25,-2; 8 -0.75,-2; 9 -0.25,-2; 10 0.25,-2; 11 0.75,-2; 12 1.25,-2; 19 1.25,2; 20 0.75,2; 21 0.25,2; 22 -0.25,2; 23 -0.75,2; 24 -1.25,2 | smd 1 x 1: PAD 0,0
LGA-14-LARGEPAD = smd 1.5 x 0.6: 1 -1.3,2; 2 -1.3,1.2; 3 -1.3,0.4; 4 -1.3,-0.4; 5 -1.3,-1.2; 6 -1.3,-2; 8 1.3,-2; 9 1.3,-1.2; 10 1.3,-0.4; 11 1.3,0.4; 12 1.3,1.2; 13 1.3,2 | smd 0.6 x 1.5: 7 0,-2.3; 14 0,2.3
A1035-H_GPS = smd 2.032 x 0.762: 1 -8.255,13.97; 2 -8.255,12.7; 3 -8.255,11.43; 4 -8.255,10.16; 5 -8.255,8.89; 6 -8.255,7.62; 7 -8.255,1.27; 8 -8.255,0; 9 -8.255,-1.27; 10 -8.255,-14.605; 11 8.255,-14.605; 12 8.255,2.54; 13 8.255,3.81; 14 8.255,5.08; 15 8.255,6.35; 16 8.255,7.62; 17 8.255,8.89; 18 8.255,10.16; 19 8.255,11.43; 20 8.255,12.7; 21 8.255,13.97 | smd 1.27 x 1.27: GND@1 -3.81,12.065; GND@2 -1.27,12.065; GND@3 1.27,12.065; GND@4 3.81,12.065; GND@5 3.81,-12.065; GND@6 1.27,-12.065; GND@7 -1.27,-12.065; GND@8 -3.81,-12.065
EIAJ-SOIC8 = smd 2.2 x 0.5: 1 -2.9,1.905; 2 -2.9,0.645; 3 -2.9,-0.625; 4 -2.9,-1.895; 5 2.9,-1.905; 6 2.9,-0.635; 7 2.9,0.635; 8 2.9,1.905
P-LCC-4_SMALLPAD = smd 1.1 x 1.5: 1 -0.75,-1.5; 2 -0.75,1.5; 3 0.75,1.5; 4 0.75,-1.5
SOT323 = smd 0.7 x 0.9: 1 -0.65,-1; 2 0.65,-1; 3 0,1
SOT223 = smd 1.219 x 2.235: 1 -2.311,-3.099; 2 0,-3.099; 3 2.311,-3.099 | smd 3.6 x 2.2: 4 0,3.099
SOT-23 = smd 0.787 x 0.889: 1 0.025,-1.016; 2 -0.94,1.016; 3 0.991,1.016
XOB17-SOLARCELL = smd 3 x 6: NEG -10.5,0; POS 10.5,0
R0805 = smd 1.3 x 1.5: 1 -0.95,0; 2 0.95,0
R1210 = smd 1.6 x 2.7: 1 -1.4,0; 2 1.4,0
PANASONIC_EVQP2_TACT-SWITCH = smd 1.45 x 1: 1 2.575,0.85; 2 2.575,-0.85; 3 -2.575,0.85; 4 -2.575,-0.85
UX60-MB-5S8 = smd 2 x 0.5: 1 8.65,1.6; 2 8.65,0.8; 3 8.65,0; 4 8.65,-0.8; 5 8.65,-1.6 | drill 0.8 long: M1 3.1,-3.65; M2 3.1,3.65; M3 8.4,3.65; M4 8.4,-3.65 | hole 0.9: 6.4,-1.75; 6.4,1.75
53047-04 = drill 0.5 pad 0.698 long: 1 1.875,0.45; 2 0.625,0.45; 3 -0.625,0.45; 4 -1.875,0.45
ABS10_SMD_CRYSTAL = smd 1.3 x 2.2: P$1 -2.1,0; P$2 2.1,0
XTAL-5.2X7.2 = smd 2.21 x 1.397: 1 -3.048,-1.27; 2 -3.048,1.27; 3 3.251,1.27 | smd 2.388 x 1.397: 4 3.162,-1.27

### Placement (x,y rotation side)
B1  31.75,7.62 0 bottom
B2  31.75,22.86 180 bottom
B3  31.75,38.1 0 bottom
C1  5,17 270 top
C2  8,17 270 top
C3  7.1,31 0 top
C4  9,38.5 180 top
C5  4.9,43.6 0 top
C6  14.3,42.8 180 top
C20  58.5,35 0 top
C21  50.7,25.9 90 top
C22  62.6,17.3 180 top
C23  68.5,27.4 270 top
C24  73.5,23.6 0 top
C25  73.5,27.8 0 top
C26  70.8,36 90 top
C30  51,12.7 90 top
C31  51,16.8 270 top
C32  45.7,8 270 top
C33  45.7,3.7 90 top
C34  55.9,38.1 270 top
C35  59.1,38.1 270 top
C38  15.3,11.7 0 top
C39  15.3,9.6 0 top
C40  41,41.9 180 top
C41  41,44 180 top
D1  5,9 270 top
D2  16,4 0 top
GND  72,30.5 0 top
GPX  55.57,14.25 0 top
IC1  9,43.2 270 top
IC2  6.5,13.4 270 top
IC20  60,27 270 top
IC30  57.4,11 180 top
IC31  58.6,42.5 90 top
IC32  27,23 90 top
IC33  48,42 180 top
LED1  66,5 0 top
LED2  66,41 0 top
Q1  11.6,6.2 270 top
Q2  5,26 90 top
Q3  13.5,37.5 90 top
Q4  23,4 90 top
Q5  30,9 180 top
Q6  46,23 270 top
Q7  30,37 0 top
Q8  32.5,4 90 top
R1  7,8 90 top
R2  9.1,8 90 top
R3  28,4 180 top
R4  7.1,33.1 180 top
R5  9,36.4 0 top
R6  9,40.6 0 top
R7  14.3,40.2 180 top
R8  18.4,42.8 0 top
R9  3.9,37.4 0 top
R10  4.4,40 180 top
R11  23,42.8 0 top
R12  27.1,42.8 0 top
R13  37,4 0 top
R20  66.7,36.7 90 top
R21  64.6,36.7 90 top
R22  62.3,4.1 0 top
R23  62.3,6.2 0 top
R30  63.6,13.4 0 top
R31  63.6,11.3 0 top
RX  66,20 0 top
SW1  70,5 270 top
SW2  70,41 270 top
TX  66,21.5 0 top
X1  76,13 180 top
X5  70.1,19.3 0 top
XT20  70.7,25.7 90 top
XT30  49.8,5.9 90 top

### Tracks (layer width: path | path; a pad name or v marks a point on that pad's centre or on a via)
+3V  (via drill 0.51)
  Top 0.2: C30.1 51.65,11.75 51.7,11.8
  Top 0.23: IC30.17 53.25,10.25 51.7,11.8 | IC30.3 60.05,10.75 60.3,11 60.3,13 60,13.3 58.65,13.3 | 58.65,13.3 IC30.7 | 58.65,13.3 58.65,13.65 60.3,15.3 v60.3,15.8 | IC31.1 55.9,40.05 C34.1 | IC31.6 60.6,39.5 59.05,39.5 C35.1 59,39.15 IC31.4
  Top 0.4: C30.1 50.15,11.75 49.8,12.1 49.8,16 | 49.8,16 49.8,17.2 50.3,17.7 50.95,17.7 C31.1 51.15,17.6 52.2,17.6 53,16.8 v53,15.9 | v48,16 49.8,16 | 50.7,25.1 51.9,25.1 52.2,25.4 IC20.19 56,25.4 | C20.1 57.6,34.95 IC20.9 57.6,31 57.7,30.9 57.7,27 | 50,42.6 50.02,42.62 IC33.3 52.33,42.62 v52.8,43.1 | v43.5,40.5 44.7,40.5 IC33.8 | 55.9,40.05 56.45,39.55 v54,39.6 | X5.4 68.17,19.9 68.1,19.9 65.5,17.3 C22.1 63.7,17.35 63.7,18.3 63.3,18.7 62.7,18.7 62.4,19 IC20.31 62.4,23 62,23.4 57.1,23.4 56,24.5 56,25.4 | C23.1 68.45,28.2 67.9,28.2 66.7,27 IC20.39 57.7,27 | 56,25.4 56.7,25.4 57.7,26.4 57.7,27
  Top 0.6: C38.1 12.7,11.7 12,11 | IC32.3 15.57,13.47 14.3,12.2 14.3,11.75 C38.1 | C38.1 C39.1
  Top 0.8: v12,10 12,11 | C21.1 50.7,25.1 v48,25.1 | v45.1,36.5 IC33.8 IC33.7
  Bottom 0.4: v60.3,15.8 60.3,15.3 59.3,14.3 54.6,14.3 v53,15.9 | v43.5,40.5 53.1,40.5 | v52.8,43.1 52.8,40.8 53.1,40.5 | 53.1,40.5 v54,39.6
  Bottom 0.8: v12,10 12,9 15,6 47,6 48,7 v48,16 48,17 47,18 47,19 48,20 v48,25.1 48.5,25.6 48.5,27.5 48,28 48,32.5 45.1,35.4 v45.1,36.5
  pour Top (isolate 0.4, rank 2, no thermals): 7.3,16.7 7.3,13.9 8.2,13.9 10.6,11.5 10.6,9.4 11,9 13,9 13,12.1 11.8,12.1 11,12.9 11,16.7
  pour Top (isolate 0.25, no thermals): 53.5,38.5 61,38.5 61,41 53.5,41
  pour Top (isolate 0.4, no thermals): 41.5,45 46.5,45 46.5,39.5 41.5,39.5
AX-CS
  Top 0.23: IC31.7 61.8,42.5 62,42.3 62,36.8 60.8,35.6 IC20.5
AX-INT1
  Top 0.23: IC31.8 62.2,43.8 62.7,43.3 62.7,36.4 61.6,35.3 IC20.4
AX-INT2
  Top 0.23: IC31.9 59.8,44.7 60.1,45 62.1,45 63.4,43.7 63.4,36 62.4,35 IC20.3
D+
  Top 0.4: X1.3 65.8,13 65.4,13.4 R30.2
D-
  Top 0.4: X1.2 65.9,12.2 65,11.3 R31.2
DEBUG-RX
  Top 0.4: IC20.32 63.2,20.2 63.7,19.7 65.4,19.7 65.7,19.7 RX.TP
DEBUG-TX
  Top 0.4: IC20.33 65.7,21.2 TX.TP
FL-CS
  Top 0.4: IC20.10 56.8,33.9 53.1,37.6 52.3,37.6 50.9,39.1 IC33.1
GND  (via drill 0.51, 1.07)  (4 unrouted)
  Top 0.2: 55.65,11.75 56.65,11.75 v56.7,11.8 | v56.7,10.2 56.7,10.3 IC30.PAD 57.65,11.25
  Top 0.23: 57.65,11.25 IC30.4 | IC30.14 55.65,11.75 | v57.4,39.8 IC31.2 57.4,42.1 57.8,42.5 59.4,42.5 59.8,42.1 IC31.5
  Top 0.4: C3.1 R4.2 | IC2.2 6.5,13.4 | LED1.1 65.25,4.25 66.5,5.5 66.5,6.25 LED1.3 66.75,7.25 67.3,7.8 v67.8,7.8 | X1.5 65.9,14.6 v65,15.5 | SW1.1 70.85,4.5 | 70.85,4.5 SW1.3 | 70.85,4.5 v72.5,4.5 | IC20.18 52.2,26.2 51.8,26.6 51.15,26.6 C21.2 | IC20.8 58.4,33.9 59,34.5 59,34.55 C20.2 | v48.9,43.1 48.9,43.6 49.2,43.9 IC33.4 | v17.4,44.4 17.4,42.8 R8.1 | LED2.1 65.25,40.25 66.4,41.4 | 66.4,41.4 66.8,41.8 66.8,42.45 LED2.3 | v68,41 66.8,41 66.4,41.4 | SW2.3 70.85,41.65 v71.5,41 70.85,40.35 SW2.1 70.85,37 C26.2 | IC20.30 61.6,17.55 C22.2 | IC20.38 67.2,26.2 67.5,26.5 68.45,26.5 C23.2 | v70.5,30.5 GND.TP | 74.4,26 v73.5,26 | 74.4,26 74.4,27.75 C25.2 | 74.4,26 74.4,23.65 C24.2 | R13.1 35,4 34.5,4.5 33.65,4.5 Q8.2 v33.5,9.5
  Top 0.6: 19.4,14.72 IC32.6
  Top 0.7: C38.2 16.6,12 17.5,12.9 18.9,12.9 19.4,13.4 19.4,14.72
  Top 0.8: C39.2 C38.2 | R12.2 v29.6,42.8 | 40,43 v38.5,43 | 40,43 40,43.95 C41.2 | 40,43 40,41.95 C40.2
  Top 1: v4,31 C3.1 | v16.3,8.1 16.3,9.55 C39.2
  Bottom 0.4: v33.5,9.5 33.5,10
  other vias: 14.9,21.7 56,23 63.5,28.5 9,11.5 43.3,9.1 6.5,42 17,36 6.5,36 2.4,43.7 14.9,24.3 17,38 12.9,44.5 10,18 14.9,19.2 14.9,26.8 39.1,26.8 39.1,24.3 39.1,21.7 39.1,19.2 52.5,14.5 57.4,37.1 64.1,25 57.4,24.6 58.9,28.5 56.5,30
  pour Bottom (isolate 0.4): 1,45 75,45 75,1 1,1
  pour Top (isolate 0.3, rank 4, no thermals): 0,45 16,45 16,41.7 11,41.7 11,35.4 0.1,35.4
  pour Top (isolate 0.4, no thermals): 21,40 17,40 16,39 16,35 17,34 21,34
  pour Top (isolate 0.3, rank 4, no thermals): 4,19 11,19 11,10 4,10
  pour Top (isolate 0.3, no thermals): 50.3,16.4 50.3,13.2 52.7,13.2 53.5,14 53.5,15 52,16.5 50.3,16.5
  pour Top (isolate 0.4, no thermals): 42.5,10 42.5,4 46.5,4 46.5,10
  pour Top (isolate 0.4): 12,33 42,33 42,15 12,15
  pour Top (isolate 0.4, rank 4, no thermals): 54.7,37.8 60.5,37.8 60.5,36.3 54.7,36.3
  pour Top (isolate 0.3, no thermals): 55,32 65,32 65,22 55,22
GPS-ON_OFF
  Top 0.4: IC32.17 18.11,29.89 19.7,28.3 24.3,28.3 28.5,32.5 39.5,32.5 39.9,32.1 39.9,29.7 40.7,28.9 42.5,28.9 43.5,29.9 44.5,29.9 44.9,29.5 44.9,23.6 45.5,23 52.5,23 53.3,23.8 IC20.21
GPS-RESET  (via drill 0.51)
  Top 0.4: IC32.1 13.03,15.43 13.1,15.5 13.1,16.1 14,17 16.5,17 16.8,17.3 21.5,17.3 22.5,16.3 v22.5,13.8 | v46,24 46.1,23.9 46.4,23.9 52.1,23.9 52.8,24.6 IC20.20
  Bottom 0.4: v22.5,13.8 22.5,9.8 24.5,7.8 43.7,7.8 45.7,9.8 45.7,16.7 45.2,17.2 45.2,19.8 46.2,20.8 46.2,23.8 v46,24
GPS-RFPWUP  (via drill 0.51)
  Top 0.4: IC32.4 16.8,14.7 16.8,15.4 16.9,15.5 16.9,15.9 17.5,16.5 20.3,16.5 21,15.8 v21,13.8 | v47,26.6 48.3,27.9 51.8,27.9 52.7,27 IC20.17
  Bottom 0.4: v21,13.8 21,10 24,7 44,7 46.5,9.5 46.5,17 46,17.5 46,19.5 47,20.5 v47,26.6
GPS-RX  (via drill 0.51)
  Top 0.4: v43.8,28.5 42.8,27.5 42.8,23.1 44.7,21.2 IC20.23 | IC32.21 13.03,33.53 14.5,35 v15,35
  Bottom 0.4: v15,35 16.5,33.5 42,33.5 43.8,31.7 v43.8,28.5
GPS-TX  (via drill 0.51)
  Top 0.4: v43.8,26.9 43.8,23.4 45.2,22 53.2,22 IC20.22 | IC32.20 14.3,32.8 v15,33.5
  Bottom 0.4: v15,33.5 15,33 15.3,32.7 41.6,32.7 42.4,31.9 42.4,28.3 v43.8,26.9
INT1  (via drill 0.51)
  Top 0.23: IC30.13 55.25,12.25 54.5,13 54.5,16.1 v55,16.6 | IC20.28 60,18.4 v59.6,18
  Bottom 0.23: v59.6,18 58.4,16.8 55.2,16.8 v55,16.6
MISO1
  Top 0.23: IC30.10 57.15,18.45 58.4,19.7 IC20.26
MISO2
  Top 0.23: IC31.12 57.4,44.7 57.1,45 55.2,45 54,43.8 54,42.7 52.7,41.4 50.9,41.4 50.85,41.35
  Top 0.4: IC20.12 53.1,31 50.8,33.3 50.8,36.7 48.6,38.9 48.6,40.6 49.35,41.35 50.85,41.35 IC33.2
MOSI1  (via drill 0.51)
  Top 0.23: IC30.11 56.65,14.55 56.5,14.7 56.5,16.7 56,17.2 v56,18 | IC20.27 59.2,19.1 v58.1,18
  Bottom 0.23: v56,18 v58.1,18
MOSI2
  Top 0.23: IC31.13 55,43.8 54.7,43.5 54.7,42.5 52.9,40.7 49.6,40.7 49.3,40.4 49.3,39.3 51.6,37 51.6,33.9 53.5,32 55,32 55.6,31.4 55.6,30.7 55.1,30.2 IC20.13
  Top 0.4: IC20.13 52.5,30.2 50,32.7 50,36.1 47.8,38.3 47.8,42.7 46.59,43.91 IC33.5
N$1
  Top 0.4: Q2.1 9.69,23.69 11,25 11,34.5 12.1,35.6 14,35.6 14.5,36.1 14.5,37.01 Q3.1
N$2
  Top 0.4: R6.2 C4.1 R5.2 11.4,36.4 11.6,36.6 12.44,36.6 Q3.2
N$3
  Top 0.23: IC30.12 56.15,13.35 55.8,13.7 55.8,14.02 GPX.TP
N$4
  Bottom 2: B1.NEG B2.POS
N$5
  Bottom 2: B2.NEG B3.POS
N$6
  Top 1: Q5.NEG 40.5,10 41,10.5 43.5,10.5 45,12 45.5,12 Q6.POS
N$7
  Top 1: R1.1 5.15,7.05 D1.A
N$8
  Top 0.35: IC1.4 10.45,42.55 11.4,41.6 11.4,39.6 12.4,38.6 12.47,38.52 Q3.3
N$9
  Top 0.35: IC1.3 8.15,42.15 8,42 8,40.65
  Top 0.4: 8,40.65 R6.1 C4.2 8.05,38.05 8,38 6.3,38 5.7,37.4 R9.2
N$10
  Top 0.4: R2.1 9,7 9.2,7 9.3,6.9 10.55,6.9 Q1.1
N$11
  Top 0.6: 24.15,4.65 24.95,4.65 25.5,4.1 26.98,4.1 R3.2 | 24.15,4.65 Q4.2 | 24.15,4.65 21.8,7 20,7 20,8.5 Q5.POS
N$12
  Top 0.4: Q1.2 3.95,5.55 3.5,6 3.5,10.6 3.7,10.8 4.8,10.8 D1.C
  pour Top (isolate 0.25, no thermals): 5.8,16.7 4,16.7 4,15 3.5,14.5 3.5,12.5 4,12 4,10.1 5.8,10.1
N$13
  Top 0.6: D2.A Q4.3
N$14
  Top 0.4: IC20.36 67.6,24.6 68.6,23.6 XT20.P$1 C24.1
N$15
  Top 0.4: IC20.37 69.9,25.4 70.7,26.2 XT20.P$2 C25.1
N$16
  Top 0.23: IC30.20 56.65,8.15 55.2,6.7 52.7,6.7 51.1,5.1 51.12,2.6 XT30.1
  Top 0.4: XT30.1 51.07,3.03 49.6,4.5 47.7,4.5 47.1,3.9 47.1,3.1 46.7,2.7 45.75,2.7 C33.1
N$17
  Top 0.23: IC30.19 56.15,8.5 54.95,7.3 48.7,7.3 48.5,7.5 48.5,8.82 XT30.3
  Top 0.4: XT30.3 45.8,9.15 C32.1
N$18  (via drill 0.51)  (1 unrouted)
  other vias: 1.4,40.1 1.4,37.5
  pour Top (isolate 0.4, no thermals): 3.8,41.5 3.8,38.8 3.8,38.5 3.6,38.3 3.6,36.8 2.3,36.8 0.9,36.8 0.9,41.5
N$19  (via drill 0.51)
  Top 0.23: IC30.16 54.25,10.75 54,11 53.5,11 52.9,11.6 52.9,12.9 v53.5,13.5 | v62.6,15 62.6,13.7
  Top 0.4: 62.6,13.7 62.65,13.7 R30.1
  Bottom 0.23: v53.5,13.5 59.6,13.5 61.1,15 v62.6,15
N$20  (via drill 0.51)
  Top 0.23: IC30.15 54.65,11.25 v53.9,12 | v61.1,13.6 61.4,13.3 61.4,11.7 61.8,11.3 R31.1
  Bottom 0.23: v53.9,12 54.7,12.8 60.3,12.8 v61.1,13.6
N$21  (via drill 0.51)
  Top 0.4: R23.1 61.2,6.2 61,6 57.9,6 57.5,5.6 v56.5,5.6 | v56,28.2 55.6,28.6 IC20.15
  Bottom 0.4: v56.5,5.6 54.7,7.4 54.3,7.4 51.1,10.6 51.1,26 53.3,28.2 v56,28.2
N$22
  Top 0.4: LED2.4 66.75,37.7 R20.2
N$23
  Top 0.4: R21.2 64.55,37.65 64.1,38.1 64.1,41.35 LED2.2
N$24  (via drill 0.51)
  Top 0.4: R22.1 61.1,4.1 61,4 55.9,4 54.9,5 v54.9,5.6 | IC20.14 51.9,29.4 v51.6,29.7
  Bottom 0.4: v54.9,5.6 53.9,6.6 53.7,6.6 50.2,10.1 50.2,28.3 v51.6,29.7
N$25
  Top 0.4: R21.1 64.6,34.6 64,34 IC20.1
N$26
  Top 0.4: LED1.4 66.75,2.55 66.5,2.3 63.9,2.3 63.3,2.9 63.3,4.05 R22.2
N$27
  Top 0.4: R23.2 64.95,6.2 LED1.2
N$28
  Top 0.4: IC20.35 66.8,23.8 68.3,22.3 69.4,22.3 70.7,21 70.7,20.07 X5.2
N$29
  Top 0.4: IC20.34 66.4,23 67.9,21.5 68.9,21.5 69.5,20.9 69.5,20.02 X5.3
N$30
  Top 0.4: IC20.43 67,30.2 67.7,30.9 67.7,34.3 68.3,34.9 68.3,37.58 SW2.2 SW2.4
N$31
  Top 0.4: IC20.44 65.8,31.6 66.7,32.5 R20.1
N$32  (via drill 0.51)
  Top 0.4: SW1.4 SW1.2 68.53,2.42 67.8,1.7 63.4,1.7 63.1,2 55.9,2 53.4,4.5 v53.4,5.6 | v48.5,18.5 48.5,19 49.1,19.6 54.7,19.6 54.9,19.8 56.3,19.8 56.8,20.3 IC20.24
  Bottom 0.4: v53.4,5.6 49.2,9.8 49.2,17.8 v48.5,18.5
N$33
  Top 0.35: C5.2 6.7,43.6 7,43.9 8.1,43.9 IC1.1 8.65,43.85 9.3,43.2 10.8,43.2 12.1,41.9 12.1,40.5 12.4,40.2 R7.2
N$34
  Top 1: Q7.POS 40.5,35 44.5,35 Q6.NEG
N$35
  Top 0.4: Q4.1 24.15,3.35 25.5,2 28,2 29,3 29,3.95 R3.1 Q8.3
PV_EN  (via drill 0.51)
  Top 0.4: v75,7 75,3 73,1 39,1 38,2 | v74,33 72.5,33 72,32.5 70.8,32.5 66.9,28.6 IC20.41 | 38,2 38,3.95 R13.2 | Q8.1 33.65,3.35 35,2 38,2
  Bottom 0.4: v75,7 75,32 v74,33
SCK1  (via drill 0.51)
  Top 0.23: IC30.8 58.15,14.15 58.8,14.8 v58.8,15.5 | v54.5,18.5 55,19 56.5,19 57.6,20.1 IC20.25
  Bottom 0.23: v58.8,15.5 58,15.5 54.5,15.5 54,16 54,18 v54.5,18.5
SCK2  (via drill 0.51)
  Top 0.23: v52.7,39.1 52.7,39.7 55.2,42.2 55.2,42.3 55.4,42.5 IC31.14
  Top 0.4: IC33.6 45.13,42.6 46.5,42.6 46.9,42.2 46.9,37.6 v48.1,36.4 | v52.7,36.4 55.2,33.8 55.7,33.8 56,33.5 IC20.11
  Bottom 0.23: v52.7,36.4 v52.7,39.1
  Bottom 0.4: v48.1,36.4 v52.7,36.4
SS1
  Top 0.23: IC30.9 57.65,14.55 57.8,14.7 57.8,16.1 58.5,16.8 59.8,16.8 60.7,17.7 60.7,19.8 60.8,19.9 IC20.29
V_BAT  (via drill 0.51)
  Top 0.4: R11.2 R12.1 26.15,44.15 v26.5,44.5 | IC20.2 63.2,31.7 63.5,31.4 64.4,31.4 65.2,32.2 65.2,33.6 v65.5,33.9 | v69,33.9 69.9,34.8 70.45,34.8 70.65,35 C26.1 70.85,35 73,35 v73.5,35.5
  Bottom 0.4: v26.5,44.5 27,45 73,45 75,43 75,37 v73.5,35.5 | v69,33.9 v65.5,33.9
VAMP  (via drill 0.51)
  Top 0.35: IC1.5 11.15,43.85 12,43 13.15,43 C6.2
  Top 0.4: C6.2 13.35,41.65 13.5,41.5 16.6,41.5 v16.8,41.3 | IC20.16 53.2,27.8 52.3,28.7 47.5,28.7 45.5,30.7 43.3,30.7 42.3,29.7 41,29.7 40.7,30 40.7,32.7 40.1,33.3 38.7,33.3 38.5,33.5 29.5,33.5 v24,39
  Bottom 0.4: v16.8,41.3 21.7,41.3 v24,39
VBAK  (via drill 0.51)
  Top 0.4: Q1.3 12.6,5.8 12,5.2 v12,4 | v22,29.5 22,31 21.92,31.08 IC32.14 21.92,31.92 22,32 22,42.75 R11.1 | Q2.2 v10,26
  Top 0.6: v12,4 D2.C
  Top 1.5: Q2.2 4.5,26 4.5,21 2.5,21 2,20.5 2,5 3,4 v12,4
  Bottom 0.4: v22,29.5 13.5,29.5 v10,26
  Bottom 1.5: v12,4 59,4 60,5 60.13,7 B1.POS
  pour Top (isolate 0.3, rank 2, no thermals): 1,34 1,3 3.5,3 3.5,20 11,20 11,34
VBUS  (via drill 0.51)
  Top 0.23: IC30.18 54.75,9.75 54.6,9.6 54.6,8.7 v54.8,8.5
  Top 0.4: C3.2 R4.1 | R1.2 R2.2 | v56.9,7 59.8,7 60.4,7.6 63.9,7.6 v65,8.7
  Top 0.5: v65,8.7 65,9.2 65.8,10 65.8,10.8 66.4,11.4 X1.1
  Top 1: Q2.3 8.1,30.95 C3.2 | v7,10.5 R1.2
  Top 1.5: v5.6,28.3 8.89,28.3 Q2.3
  Bottom 0.4: v54.8,8.5 56.3,7 v56.9,7
  Bottom 1.5: v5.6,28.3 7,26.9 v7,10.5 7,6 11,2 64,2 65,3 v65,8.7
VREF  (via drill 0.51)
  Top 0.4: v19.5,44.5 19.35,44.35 R8.2 19,42.45 19,41.9 17.3,40.2 R7.1 | v73.6,42 73.6,38 74.6,37 74.6,35.1 73.7,34.2 72.3,34.2 71.9,33.8 70.6,33.8 v69.3,32.5 | v62.8,30.3 60.1,30.3 59.2,31.2 IC20.7
  Bottom 0.4: v19.5,44.5 23.5,44.5 24.6,43.4 27,43.4 27.8,44.2 72.7,44.2 73.6,43.3 v73.6,42 | v69.3,32.5 65,32.5 v62.8,30.3